# Altium schematic sheet Connectors.SchDoc
size A4; SheetNumber: 7; SheetTotal: 7
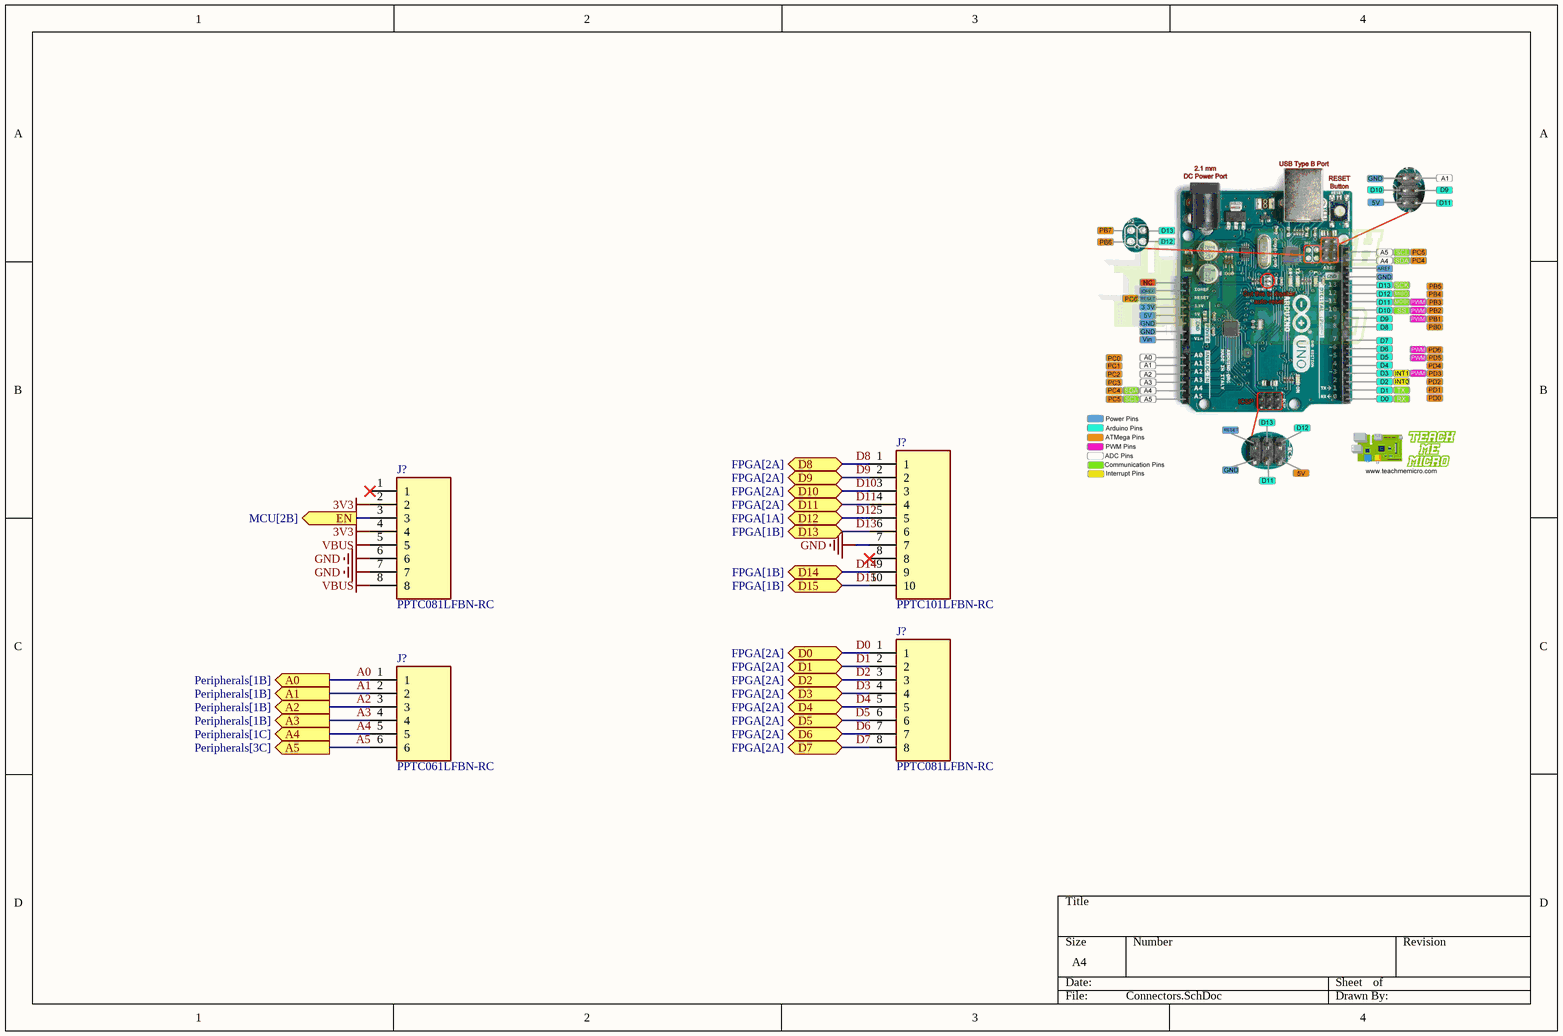
[diagram p0: Connectors.SchDoc]

## Parts
(Parts that share a designator on the sheet are numbered #1, #2 ... from top to bottom, then left to right.)
J?#1  PPTC101LFBN-RC  [RHDR10W80P0X254_1X10_2590X254X850P]
J?#2  PPTC081LFBN-RC  [RHDR8W80P0X254_1X8_2082X254X850P]
J?#3  PPTC081LFBN-RC  [RHDR8W80P0X254_1X8_2082X254X850P]
J?#4  PPTC061LFBN-RC  [RHDR6W80P0X254_1X6_1574X254X870P]

## Ports
A0 (out, see Peripherals[1B]), A1 (out, see Peripherals[1B]), A2 (out, see Peripherals[1B]), A3 (out, see Peripherals[1B]), A4 (out, see Peripherals[1C]), A5 (out, see Peripherals[3C]), D0 (bidir, see FPGA[2A]), D1 (bidir, see FPGA[2A]), D2 (bidir, see FPGA[2A]), D3 (bidir, see FPGA[2A]), D4 (bidir, see FPGA[2A]), D5 (bidir, see FPGA[2A]), D6 (bidir, see FPGA[2A]), D7 (bidir, see FPGA[2A]), D8 (bidir, see FPGA[2A]), D9 (bidir, see FPGA[2A]), D10 (bidir, see FPGA[2A]), D11 (bidir, see FPGA[2A]), D12 (bidir, see FPGA[1A]), D13 (bidir, see FPGA[1B]), D14 (bidir, see FPGA[1B]), D15 (bidir, see FPGA[1B]), EN (out, see MCU[2B])

## Nets
3V3: J?#2.2 J?#2.4
GND: J?#1.7 J?#2.6 J?#2.7
VBUS: J?#2.5 J?#2.8
A0: J?#4.1 ; port A0
A1: J?#4.2 ; port A1
A2: J?#4.3 ; port A2
A3: J?#4.4 ; port A3
A4: J?#4.5 ; port A4
A5: J?#4.6 ; port A5
D0: J?#3.1 ; port D0
D1: J?#3.2 ; port D1
D2: J?#3.3 ; port D2
D3: J?#3.4 ; port D3
D4: J?#3.5 ; port D4
D5: J?#3.6 ; port D5
D6: J?#3.7 ; port D6
D7: J?#3.8 ; port D7
D8: J?#1.1 ; port D8
D9: J?#1.2 ; port D9
D10: J?#1.3 ; port D10
D11: J?#1.4 ; port D11
D12: J?#1.5 ; port D12
D13: J?#1.6 ; port D13
D14: J?#1.9 ; port D14
D15: J?#1.10 ; port D15
EN: J?#2.3 ; port EN

Not connected (* = marked no-connect by the designer): J?#1 8*; J?#2 1*

## Library data of the parts
J?#1 = PPTC101LFBN-RC: Connector; Manufacturer_Name: Sullins; Datasheet Link: http://www.sullinscorp.com/drawings/78_P(N)PxCxxxLFBN-RC,_10492-H.pdf; Height: 8.5mm; Manufacturer_Part_Number: PPTC101LFBN-RC
J?#2 J?#3 = PPTC081LFBN-RC: Connector; Manufacturer_Name: Sullins; Datasheet Link: http://sullinscorp.com/catalogs/101_PAGE114-115_.100_FEMALE_HDR.pdf; Height: 8.5mm; Manufacturer_Part_Number: PPTC081LFBN-RC
J?#4 = PPTC061LFBN-RC: Connector; Manufacturer_Name: Sullins; Datasheet Link: http://www.sullinscorp.com/drawings/78_P(N)PxCxxxLFBN-RC,_10492-H.pdf; Height: 8.7mm; Manufacturer_Part_Number: PPTC061LFBN-RC